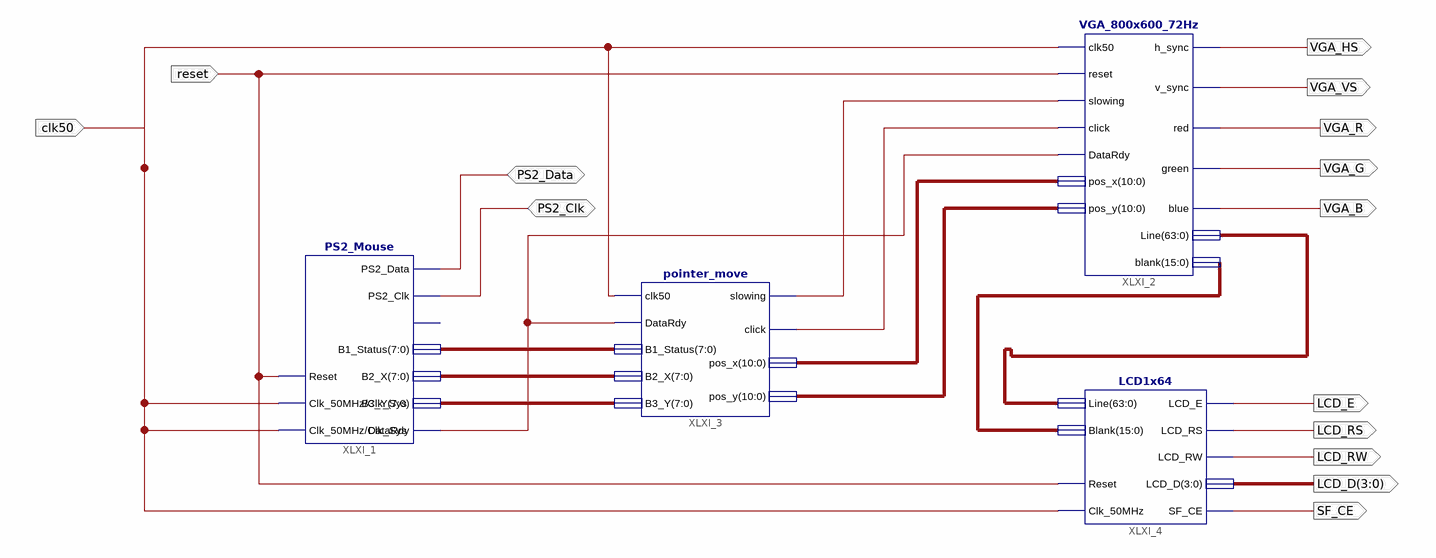
[diagram p0: schematic sheet 1]
// Xilinx ISE schematic schematic.sch (spartan3e) as structural Verilog: 4 symbols, 14 ports
module schematic (
  input  reset,
  input  clk50,
  inout  PS2_Data,
  inout  PS2_Clk,
  output VGA_HS,
  output VGA_VS,
  output VGA_R,
  output VGA_G,
  output VGA_B,
  output LCD_E,
  output LCD_RS,
  output LCD_RW,
  output [3:0] LCD_D,
  output SF_CE
);

  wire XLXN_16, XLXN_17, XLXN_18;
  wire [7:0] XLXN_11, XLXN_12, XLXN_13;
  wire [10:0] XLXN_19, XLXN_20;
  wire [15:0] XLXN_33;
  wire [63:0] XLXN_37;

  VGA_800x600_72Hz XLXI_2 (
    .clk50(clk50), .reset(reset), .slowing(XLXN_16), .click(XLXN_17), .DataRdy(XLXN_18), .pos_x(XLXN_19),
    .pos_y(XLXN_20), .h_sync(VGA_HS), .v_sync(VGA_VS), .red(VGA_R), .green(VGA_G), .blue(VGA_B),
    .Line(XLXN_37), .blank(XLXN_33));
  pointer_move XLXI_3 (
    .clk50(clk50), .DataRdy(XLXN_18), .B1_Status(XLXN_11), .B2_X(XLXN_12), .B3_Y(XLXN_13), .slowing(XLXN_16),
    .click(XLXN_17), .pos_x(XLXN_19), .pos_y(XLXN_20));
  PS2_Mouse XLXI_1 (
    .PS2_Data(PS2_Data), .PS2_Clk(PS2_Clk), .DataRdy(XLXN_18), .B1_Status(XLXN_11), .B2_X(XLXN_12),
    .B3_Y(XLXN_13), .Clk_50MHz(clk50), .Reset(reset), .Clk_Sys(clk50));  // open: InitOK
  LCD1x64 XLXI_4 (
    .Clk_50MHz(clk50), .Reset(reset), .Line(XLXN_37), .Blank(XLXN_33), .LCD_D(LCD_D), .LCD_E(LCD_E),
    .LCD_RW(LCD_RW), .LCD_RS(LCD_RS), .SF_CE(SF_CE));
endmodule
